# EAGLE design CMoy Ampli (EAGLE 6.4)
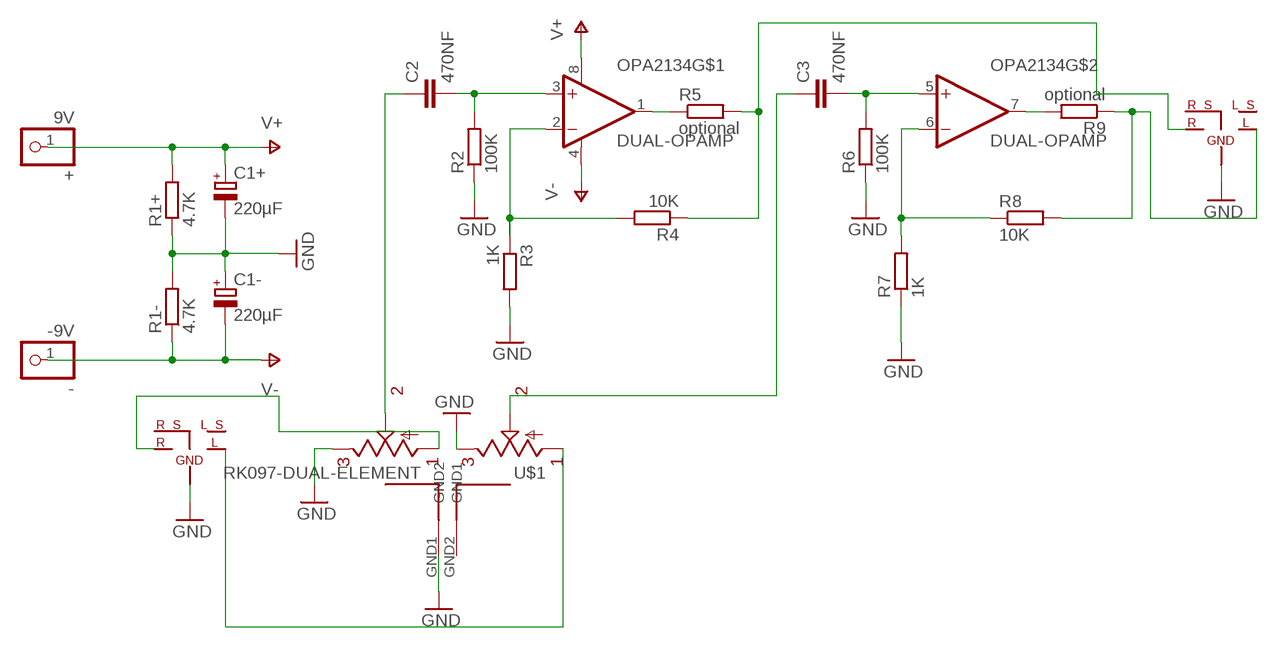
[diagram p0: schematic, sheet 1]

## Parts
+  9V  PINHD-1X1  [1X01]
-  -9V  PINHD-1X1  [1X01]
C1+  220µF  CPOL-EUE3.5-8  [E3,5-8]
C1-  220µF  CPOL-EUE3.5-8  [E3,5-8]
C2  470NF  C-EU075-042X103  [C075-042X103]
C3  470NF  C-EU075-042X103  [C075-042X103]
OPA2134  DUAL-OPAMP  [DIP-8]
R1+  4.7K  R-EU_0309/V  [0309V]
R1-  4.7K  R-EU_0309/V  [0309V]
R2  100K  R-EU_0309/V  [0309V]
R3  1K  R-EU_0309/V  [0309V]
R4  10K  R-EU_0309/V  [0309V]
R5  optional  R-EU_0309/V  [0309V]
R6  100K  R-EU_0309/V  [0309V]
R7  1K  R-EU_0309/V  [0309V]
R8  10K  R-EU_0309/V  [0309V]
R9  optional  R-EU_0309/V  [0309V]
U$1  RK097-DUAL-ELEMENT  [RK097-DUAL-ELEMENT]
U$2  EBS35  [EBS35]
U$3  EBS35  [EBS35]

## Nets
GND: C1+.- C1-.+ R1+.1 R1-.2 R2.1 R3.2 R6.1 R7.1 U$1.GND1(GND2) U$1.IN1 U$1.IN2 U$2.GND U$3.GND
L: C3.1 U$1.AMP2
L+: C3.2 OPA2134.5(+IN) R6.2
L-: OPA2134.6(-IN) R7.2 R8.1
L_IN: U$1.GND12 U$2.L
L_OUT: R8.2 R9.1 U$3.L
N$2: OPA2134.2(-IN) R3.1 R4.2
N$4: OPA2134.1(OUT) R5.1
OPT_L: OPA2134.7(OUT) R9.2
R: C2.1 U$1.AMP1
R+: C2.2 OPA2134.3(+IN) R2.2
R_IN: U$1.GND11 U$2.R
R_OUT: R4.1 R5.2 U$3.R
V+: +.1 C1+.+ OPA2134.8(V+) R1+.2
V-: -.1 C1-.- OPA2134.4(V-) R1-.1
Unconnected: U$1.GND2(GND1) U$2.L_SENS(L_S) U$2.R_SENS(R_S) U$3.L_SENS(L_S) U$3.R_SENS(R_S)

## Library data of the parts
+ - = pinhead:PINHD-1X1: PIN HEADER
C1+ C1- = resistor:CPOL-EU: POLARIZED CAPACITOR, European symbol
C2 C3 = rcl:C-EU: CAPACITOR, European symbol
OPA2134 = opamps:DUAL-OPAMP: Generic 2-channel DIP-8 opamp
R1+ R1- R2-R9 = resistor:R-EU_: RESISTOR, European symbol
U$1 = alps_japan_potentiometers:RK097-DUAL-ELEMENT: SCHEMATIC FOR DUAL POTENTIOMETER
U$2 U$3 = EBS35:EBS35

## Board
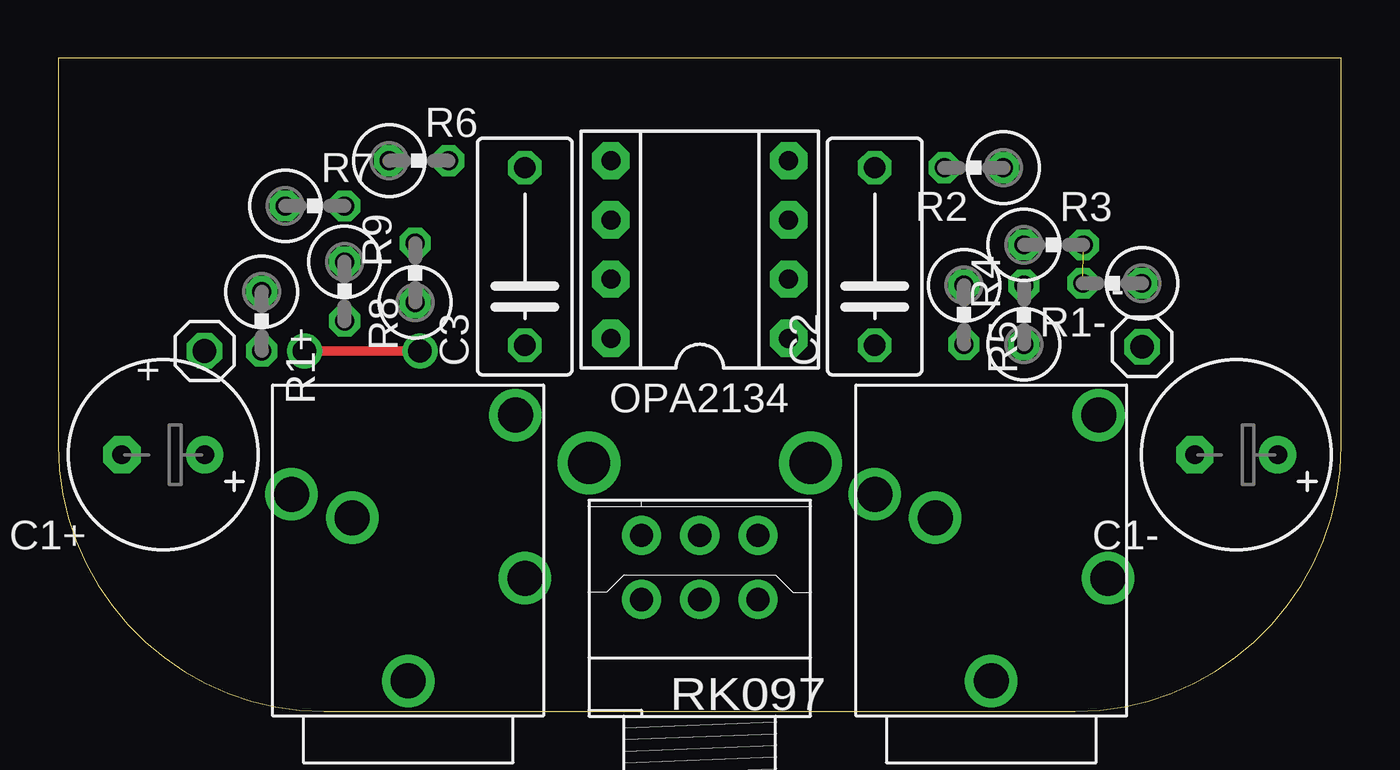
[diagram p1: board, top side]
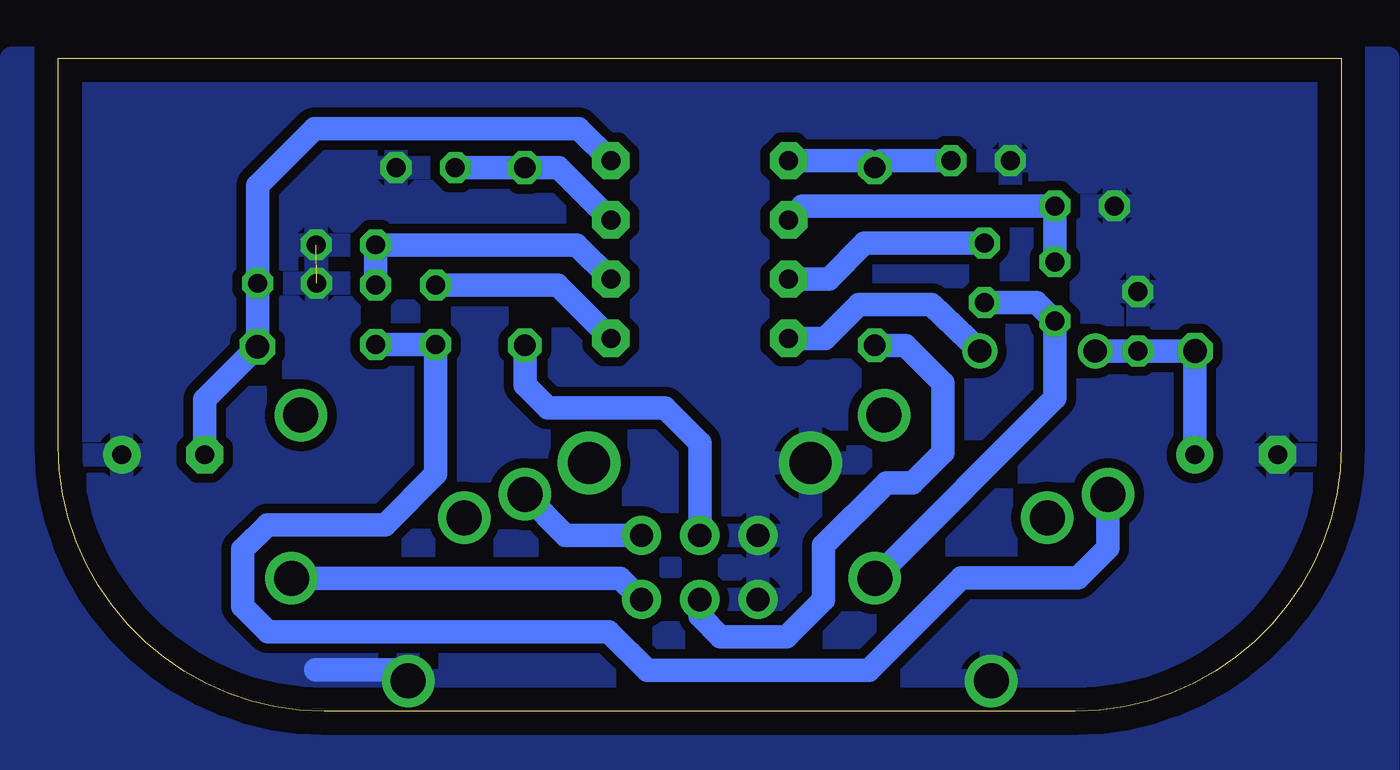
[diagram p2: board, bottom side, seen from below]

Size 55 x 28 mm. Coordinates in mm from the lower left corner, seen from the top.
Outline: 55,28 0,28 0,11.4 arc90 11.4,0 43.6,0 arc90 55,11.4 55,28
Copper layers (1*16): Top 0.035mm / dielectric 1.5mm / Bottom 0.035mm
Design rules "default": minimum track width 10mil, minimum drill 24mil, track to track 8mil, track to pad 8mil, pad to pad 8mil, via to via 8mil, smd to smd 8mil, copper to edge 40mil, drill to drill 8mil, minimum pad ring 10mil, minimum via ring 8mil, stop-mask expansion 4mil, vias tented up to drill 0mil, thermal gap 10mil

### Footprints (pad centres in the part's own frame; a part is rotated, then mirrored left to right if it is on the bottom)
1X01 = drill 1.016 octagon: 1 0,0
E3,5-8 = drill 0.813 pad 1.6: + -1.778,0 | drill 0.813 pad 1.6 octagon: - 1.778,0
C075-042X103 = drill 0.914 octagon: 1 -3.81,0; 2 3.81,0
DIP-8 = drill 0.813 pad 1.6 octagon: 1 -3.81,3.81; 2 -3.81,1.27; 3 -3.81,-1.27; 4 -3.81,-3.81; 5 3.81,-3.81; 6 3.81,-1.27; 7 3.81,1.27; 8 3.81,3.81
0309V = drill 0.813 octagon: 1 -1.27,0; 2 1.27,0
RK097-DUAL-ELEMENT = drill 1 pad 1.676: AMP1 0,2.69; AMP2 0,-0.06; GND11 2.5,2.69; GND12 2.5,-0.06; IN1 -2.5,2.69; IN2 -2.5,-0.06 | drill 1.8 pad 2.54: GND1 -4.75,5.8; GND2 4.75,5.8
EBS35 = drill 1.5: GND 0,0; L 5,4.4; L_SENS 4.6,11.4; R -5,8; R_SENS -2.4,7

### Placement (x,y rotation side)
+  6.27,15.45 90 top
-  46.46,15.63 0 top
C1+  4.5,11 180 top
C1-  50.5,11 180 top
C2  35,19.5 90 top
C3  20,19.5 90 top
OPA2134  27.5,19.8 180 top
R1+  8.72,16.72 270 top
R1-  45.19,18.35 180 top
R2  39.25,23.31 180 top
R3  42.67,20 0 top
R4  41.4,17 90 top
R5  38.83,17 270 top
R6  15.46,23.61 0 top
R7  11,21.67 0 top
R8  12.27,18 270 top
R9  15.3,18.8 90 top
U$1  27.5,4.85 0 top
U$2  40,1.3 0 top
U$3  15,1.3 0 top

### Tracks (layer width: path | path; a pad name or v marks a point on that pad's centre or on a via)
GND  (1 unrouted)
  Bottom 1.016: U$2.GND 40,1.77 43.97,1.77
  pour Bottom (isolate 0.406): -2,28 57,28 57,-4 -2,-4
L
  Bottom 1.016: C3.1 18.69,15.69 17.08,14.08 17.08,11.09 18.38,9.79 19.5,9.79 22.19,7.1 22.19,4.78 23.78,3.19 26.61,3.19 27.5,4.08 U$1.AMP2
L+
  Bottom 1.016: R6.2 19.7,23.61 C3.2 20.3,23.61 OPA2134.5
L-
  Bottom 1.016: OPA2134.6 23.09,21.67 R7.2 R8.1
L_IN
  Bottom 1.016: U$1.GND12 30.91,5.7 U$2.L
L_OUT
  Bottom 1.016: U$3.L 12.27,13.43 R8.2 13.07,17.53 R9.1
N$2
  Bottom 1.016: OPA2134.2 32.78,20 R3.1 R4.2
N$4
  Bottom 1.016: OPA2134.1 33.59,18.27 R5.1
OPT_L
  Bottom 1.016: OPA2134.7 21.97,18.53 20.43,20.07 R9.2
R
  Bottom 1.016: U$1.AMP1 27.5,11.5 29,13 34,13 35,14 C2.1
R+
  Bottom 1.016: R2.2 C2.2 33.55,23.31 OPA2134.3
R_IN
  Bottom 1.016: U$1.GND11 33.25,7.54 U$2.R
R_OUT
  Bottom 1.016: U$3.R 10,7 11.29,5.71 16.29,5.71 20.25,1.75 29.75,1.75 31.41,3.41 46.01,3.41 47.1,4.5 47.1,6.93 46.03,8 41,8 38.83,10.17 R5.2 R4.1
V+  (via drill 1)
  Top 0.406: v10.55,15.45 v15.5,15.45
  Bottom 1.016: OPA2134.8 22.14,15.99 20.68,17.45 17.56,17.45 v15.5,15.45 | C1+.+ +.1 R1+.2 v10.55,15.45
V-
  Bottom 1.016: C1-.- 48.72,13.37 -.1 R1-.1 46.46,22.54 44.01,24.99 32.69,24.99 OPA2134.4